# EAGLE design MotorDriver (EAGLE 9.6.2)
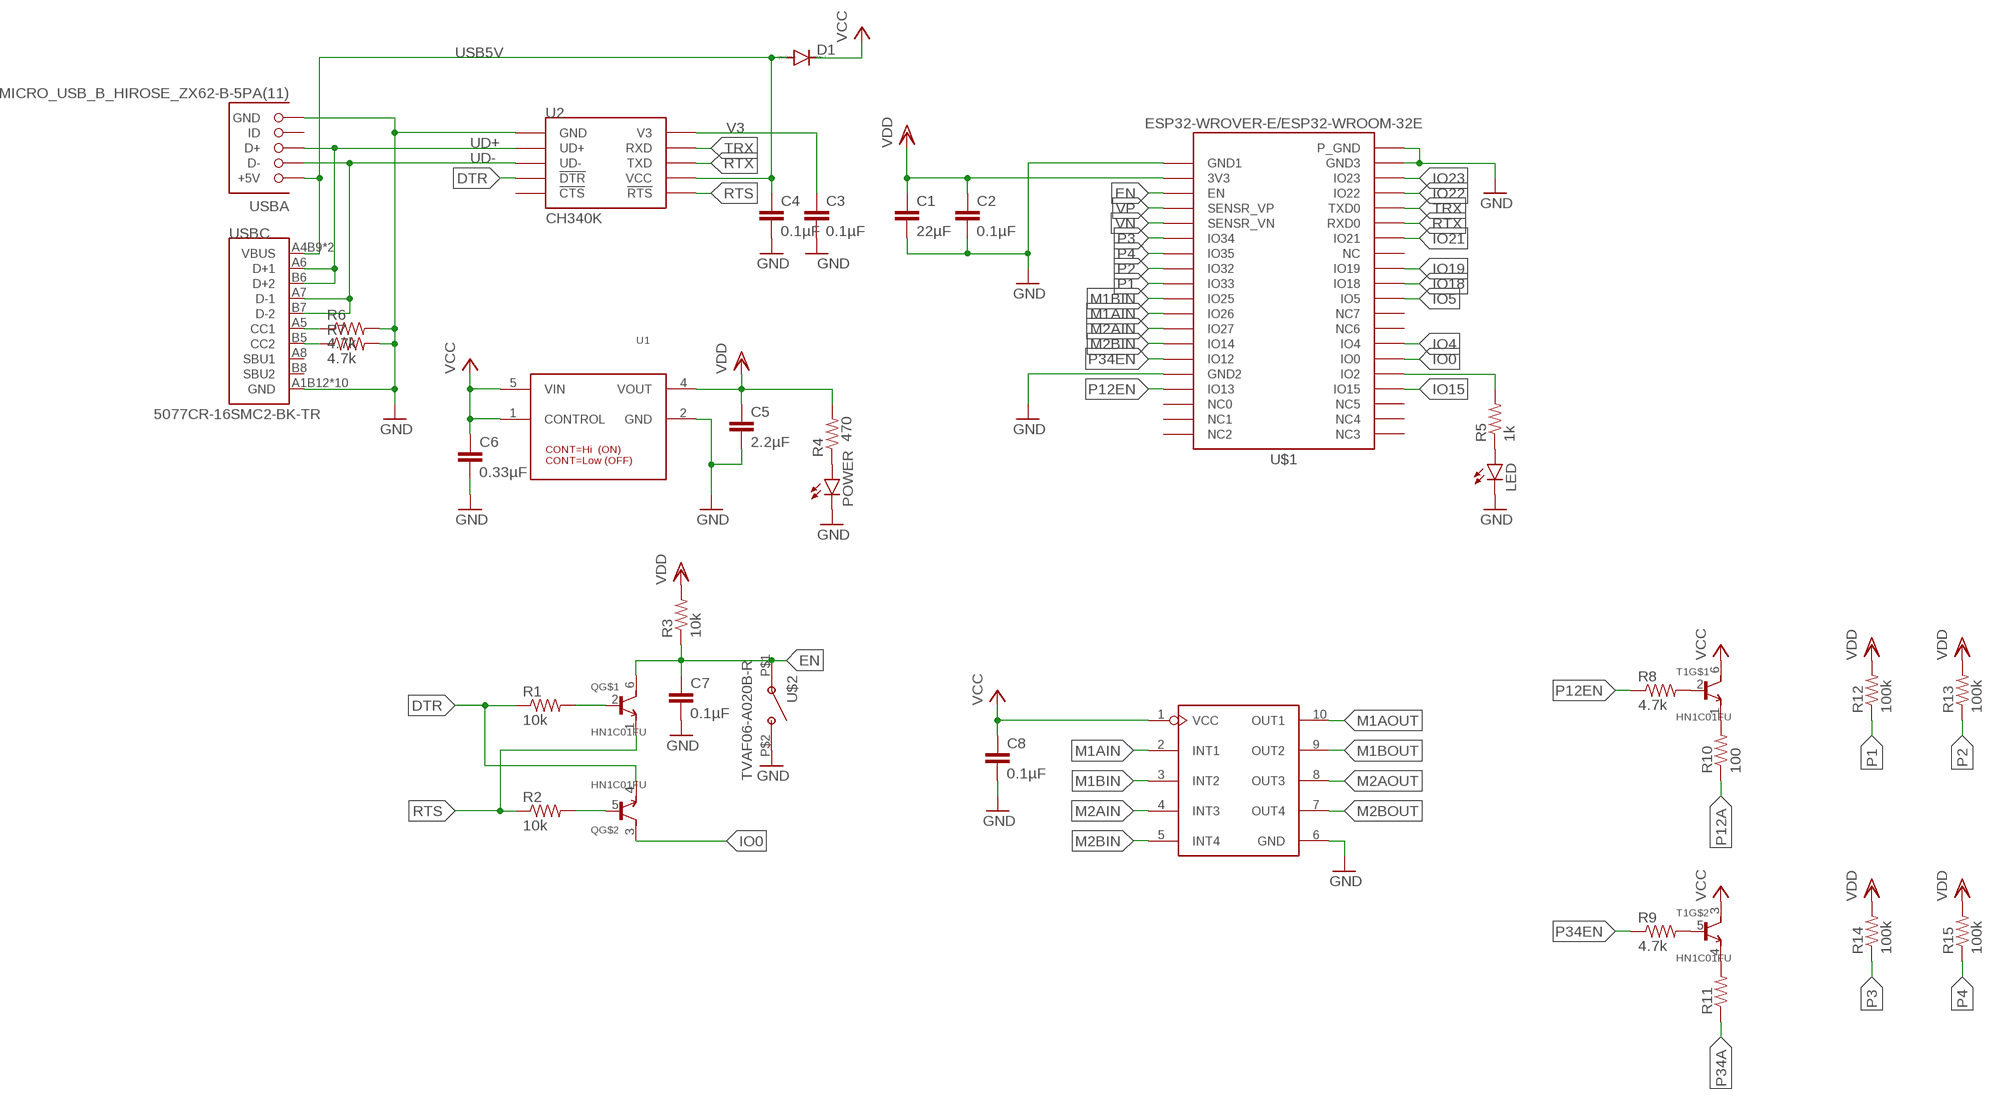
[diagram p0: schematic, sheet 1]

## Parts
C1  22µF  C-EUC0603K  [C0603K]
C2  0.1µF  C-EUC0603K  [C0603K]
C3  0.1µF  C-EUC0603K  [C0603K]
C4  0.1µF  C-EUC0603K  [C0603K]
C5  2.2µF  C-EUC0603K  [C0603K]
C6  0.33µF  C-EUC0603K  [C0603K]
C7  0.1µF  C-EUC0603K  [C0603K]
C8  0.1µF  C-EUC0603  [C0603]
D1  DIODE-SOD123  [SOD123]
LED  LEDCHIPLED_0603  [CHIPLED_0603]
POWER  LEDCHIPLED_0603  [CHIPLED_0603]
Q  HN1C01FU  [SOT-363]
R1  10k  R-US_R0603  [R0603]
R2  10k  R-US_R0603  [R0603]
R3  10k  R-US_R0603  [R0603]
R4  470  R-US_R0603  [R0603]
R5  1k  R-US_R0603  [R0603]
R6  4.7k  R-US_R0603  [R0603]
R7  4.7k  R-US_R0603  [R0603]
R8  4.7k  R-US_R0603  [R0603]
R9  4.7k  R-US_R0603  [R0603]
R10  100  R-US_R0603  [R0603]
R11  R-US_R0603  [R0603]
R12  100k  R-US_R0603  [R0603]
R13  100k  R-US_R0603  [R0603]
R14  100k  R-US_R0603  [R0603]
R15  100k  R-US_R0603  [R0603]
T1  HN1C01FU  [SOT-363]
U1  I-10673_NJM2884U1-33  [NJM2884U1-33]
U2  CH340K  [ESSOP-10]
U3  DRIVER-LV8548MC-AH(SOIC10)  [SOIC10-1.0-5X4MM]
U$1  ESP32-WROVER-E/ESP32-WROOM-32E  [ESP32-WROVER-E/ESP32-WROOM-32E]
U$2  TVAF06-A020B-R  [TVAF06-A020B-R]
USBA  MICRO_USB_B_HIROSE_ZX62-B-5PA(11)  [USB_MICRO_B-HIROSE-ZX62-B-5PA(11)]
USBC  5077CR-16SMC2-BK-TR  [5077CR-16SMC2-BK-TR]

## Nets
DTR: Q.4(E) R1.1 U2.P4(!DTR!)
EN: C7.1 Q.6(C) R3.1 U$1.EN U$2.P$1(A)
GND: C1.2 C2.2 C3.2 C4.2 C5.2 C6.2 C7.2 C8.2 LED.C POWER.C R6.2 R7.2 U1.2(GND) U2.P0(GND) U2.P3(GND) U3.6(GND) U$1.GND1 U$1.GND2 U$1.GND2'(GND2) U$1.GND3 U$1.P_GND U$2.P$2(B) USBA.5(GND) USBC.A1B12(GND) USBC.B1A12(GND) USBC.P$1(GND) USBC.P$2(GND) USBC.P$3(GND) USBC.P$4(GND) USBC.P$5(GND) USBC.P$6(GND) USBC.P$7(GND) USBC.P$8(GND)
IO0: Q.3(C) U$1.IO0
IO2: R5.2 U$1.IO2 U$1.IO2'(IO2)
IO4: U$1.IO4
IO5: U$1.IO5
IO15: U$1.IO15 U$1.IO15'(IO15)
IO18: U$1.IO18
IO19: U$1.IO19
IO21: U$1.IO21
IO22: U$1.IO22
IO23: U$1.IO23
M1AIN: U3.2(INT1) U$1.IO26
M1AOUT: U3.10(OUT1)
M1BIN: U3.3(INT2) U$1.IO25
M1BOUT: U3.9(OUT2)
M2AIN: U3.4(INT3) U$1.IO27
M2AOUT: U3.8(OUT3)
M2BIN: U3.5(INT4) U$1.IO14
M2BOUT: U3.7(OUT4)
N$1: LED.A R5.1
N$14: Q.2(B) R1.2
N$15: Q.5(B) R2.2
N$16: R8.2 T1.2(B)
N$17: R9.2 T1.5(B)
N$18: R10.2 T1.1(E)
N$20: R11.2 T1.4(E)
N$67: R6.1 USBC.A5(CC1)
N$84: POWER.A R4.1
N$107: R7.1 USBC.B5(CC2)
P1: R12.1 U$1.IO33
P2: R13.1 U$1.IO32
P3: R14.1 U$1.IO34
P4: R15.1 U$1.IO35
P12A: R10.1
P12EN: R8.1 U$1.IO13 U$1.IO13'(IO13)
P34A: R11.1
P34EN: R9.1 U$1.IO12
RTS: Q.1(E) R2.1 U2.P6(!RTS!)
RTX: U2.P8(TXD) U$1.RXD0
TRX: U2.P9(RXD) U$1.TXD0
UD+: U2.P1(UD+) USBA.3(D+) USBC.A6(D+1) USBC.B6(D+2)
UD-: U2.P2(UD-) USBA.2(D-) USBC.A7(D-1) USBC.B7(D-2)
USB5V: C4.1 D1.A U2.P7(VCC) USBA.1(+5V) USBC.A4B9(VBUS) USBC.B4A9(VBUS)
V3: C3.1 U2.P10(V3)
VCC: C6.1 C8.1 D1.C T1.3(C) T1.6(C) U1.1(CONTROL) U1.5(VIN) U3.1(VCC)
VDD: C1.1 C2.1 C5.1 R3.2 R4.2 R12.2 R13.2 R14.2 R15.2 U1.4(VOUT) U$1.3V3
VN: U$1.SENSOR_VN(SENSR_VN)
VP: U$1.SENSOR_VP(SENSR_VP)
Unconnected: U2.P5(!CTS!) U$1.IO16(NC6) U$1.IO17(NC7) U$1.NC U$1.NC0 U$1.NC0'(NC0) U$1.NC1 U$1.NC1'(NC1) U$1.NC2 U$1.NC2'(NC2) U$1.NC3 U$1.NC3'(NC3) U$1.NC4 U$1.NC4'(NC4) U$1.NC5 U$1.NC5'(NC5) USBA.4(ID) USBC.A8(SBU1) USBC.B8(SBU2)

## Library data of the parts
C1-C8 = rcl:C-EU: CAPACITOR, European symbol; SPICEPREFIX: C
D1 = diode:DIODE-: DIODE
LED POWER = led:LED: LED OSRAM: - CHIPLED LG R971, LG N971, LY N971, LG Q971, LY Q971, LO R971, LY R971 LH N974, LH R974 LS Q976, LO Q976, LY Q976 LO Q996 - Hyper CHIPLED LW Q18S LB Q993, LB Q99A, LB R99A - SideLED LS A670, LO A670, LY A670, LG A670, LP A670 LB A673, LV A673, LT A673, LW A673 LH A674 LY A675 LS A676, LA A676, LO A676, LY A676, LW A676 LS A679, LY A679, LG A679 - Hyper Micro SIDELED® LS Y876, LA Y876, LO Y876, LY Y876 LT Y87S - SmartLED LW L88C, LW L88S LB L89C, LB L89S, LG L890 LS L89K, LO L89K, LY L89K LS L896, LA L896, LO L896, LY L896 - TOPLED LS T670, LO T670, LY T670, LG T670, LP T670 LSG T670, LSP T670, LSY T670, LOP T670, LYG T670 LG T671, LOG T671, LSG T671 LB T673, LV T673, LT T673, LW T673 LH T674 LS T676, LA T676, LO T676, LY T676, LB T676, LH T676, LSB T676, LW T676 LB T67C, LV T67C, LT T67C, LS T67K, LO T67K, LY T67K, LW E67C LS E67B, LA E67B, LO E67B, LY E67B, LB E67C, LV E67C, LT E67C LW T67C LS T679, LY T679, LG T679 LS T770, LO T770, LY T770, LG T770, LP T770 LB T773, LV T773, LT T773, LW T773 LH T774 LS E675, LA E675, LY E675, LS T675 LS T776, LA T776, LO T776, LY T776, LB T776 LHGB T686 LT T68C, LB T68C - Hyper Mini TOPLED® LB M676 - Mini TOPLED Santana® LG M470 LS M47K, LO M47K, LY M47K Source: http://www.osram.convergy.de LUXEON: - LUMILED® LXK2-PW12-R00, LXK2-PW12-S00, LXK2-PW14-U00, LXK2-PW14-V00 LXK2-PM12-R00, LXK2-PM12-S00, LXK2-PM14-U00 LXK2-PE12-Q00, LXK2-PE12-R00, LXK2-PE12-S00, LXK2-PE14-T00, LXK2-PE14-U00 LXK2-PB12-K00, LXK2-PB12-L00, LXK2-PB12-M00, LXK2-PB14-N00, LXK2-PB14-P00, LXK2-PB14-Q00 LXK2-PR12-L00, LXK2-PR12-M00, LXK2-PR14-Q00, LXK2-PR14-R00 LXK2-PD12-Q00, LXK2-PD12-R00, LXK2-PD12-S00 LXK2-PH12-R00, LXK2-PH12-S00 LXK2-PL12-P00, LXK2-PL12-Q00, LXK2-PL12-R00 Source: www.luxeon.com KINGBRIGHT: KA-3528ASYC Source: www.kingbright.com
Q T1 = transistors:HN1C01FU
R1-R15 = rcl:R-US_: RESISTOR, American symbol; SPICEPREFIX: R
U1 = akizuki:I-10673_NJM2884U1-33
U2 = CH340:CH340K
U3 = DRIVER-LV8548MC-AH_SOIC10_:DRIVER-LV8548MC-AH(SOIC10): 310030259 Check prices <https://pricing.snapeda.com/parts/LV8548MC-AH/ON%20Semiconductor/view-part?ref=eda>; AVAILABILITY: Not in stock; DESCRIPTION: Half Bridge (4) Driver DC Motors, General Purpose, Stepper Motors DMOS 10-SOIC; MF: ON Semiconductor; MP: LV8548MC-AH; PACKAGE: SOIC NB-10 ON Semiconductor; PRICE: None
U$1 = esp32:ESP32-WROVER-E/ESP32-WROOM-32E
U$2 = switches:TVAF06-A020B-R
USBA = connector:MICRO_USB_B_HIROSE_ZX62-B-5PA(11): Connector Receptacle USB - micro B 2.0 5 Position Surface Mount, Right Angle, Horizontal Bottom Mount; DIGIKEY: H11634CT-ND; MOUSER: 798-ZX62-B-5PA11; NEWARK: 86P8793
USBC = connectors:5077CR-16SMC2-BK-TR

## Board
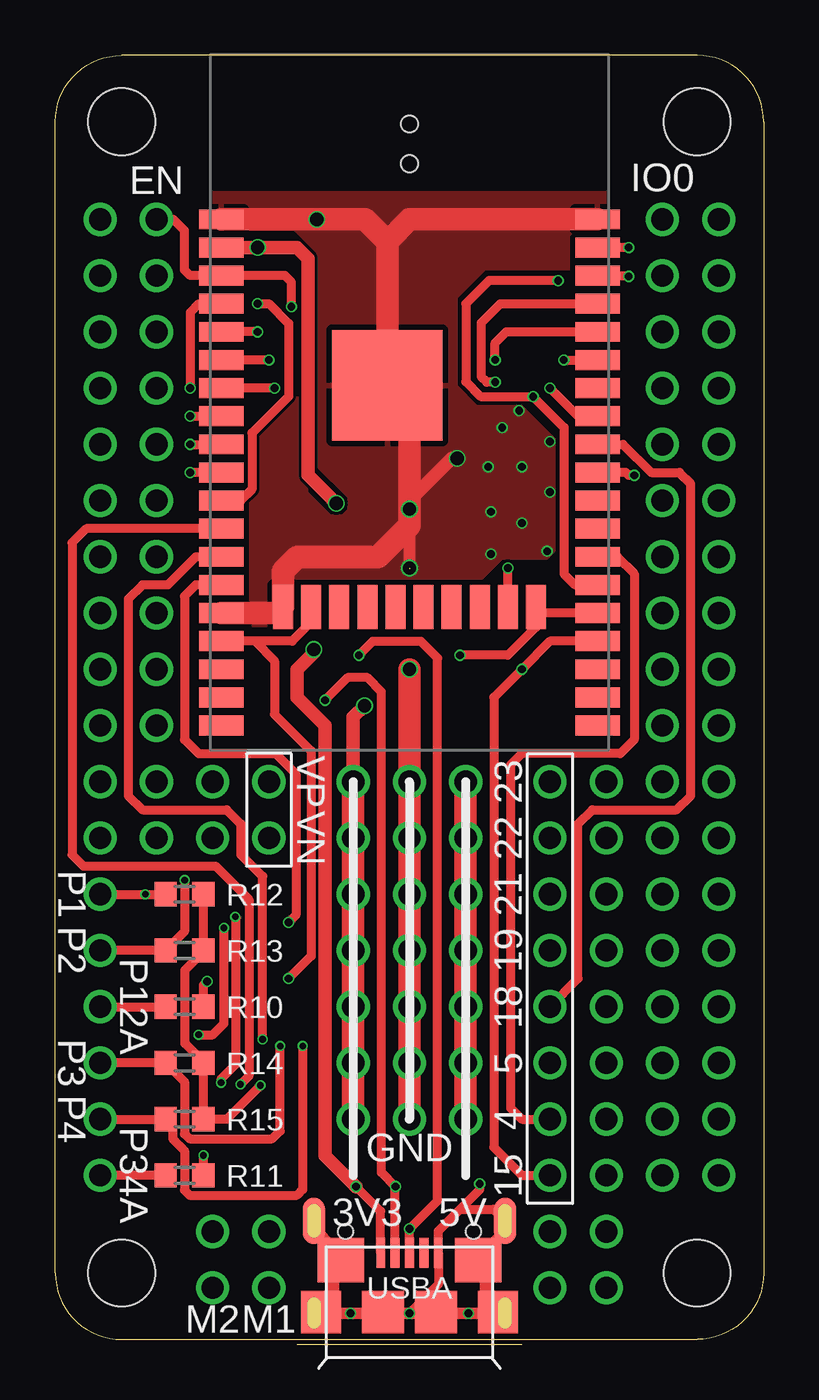
[diagram p1: board, top side]
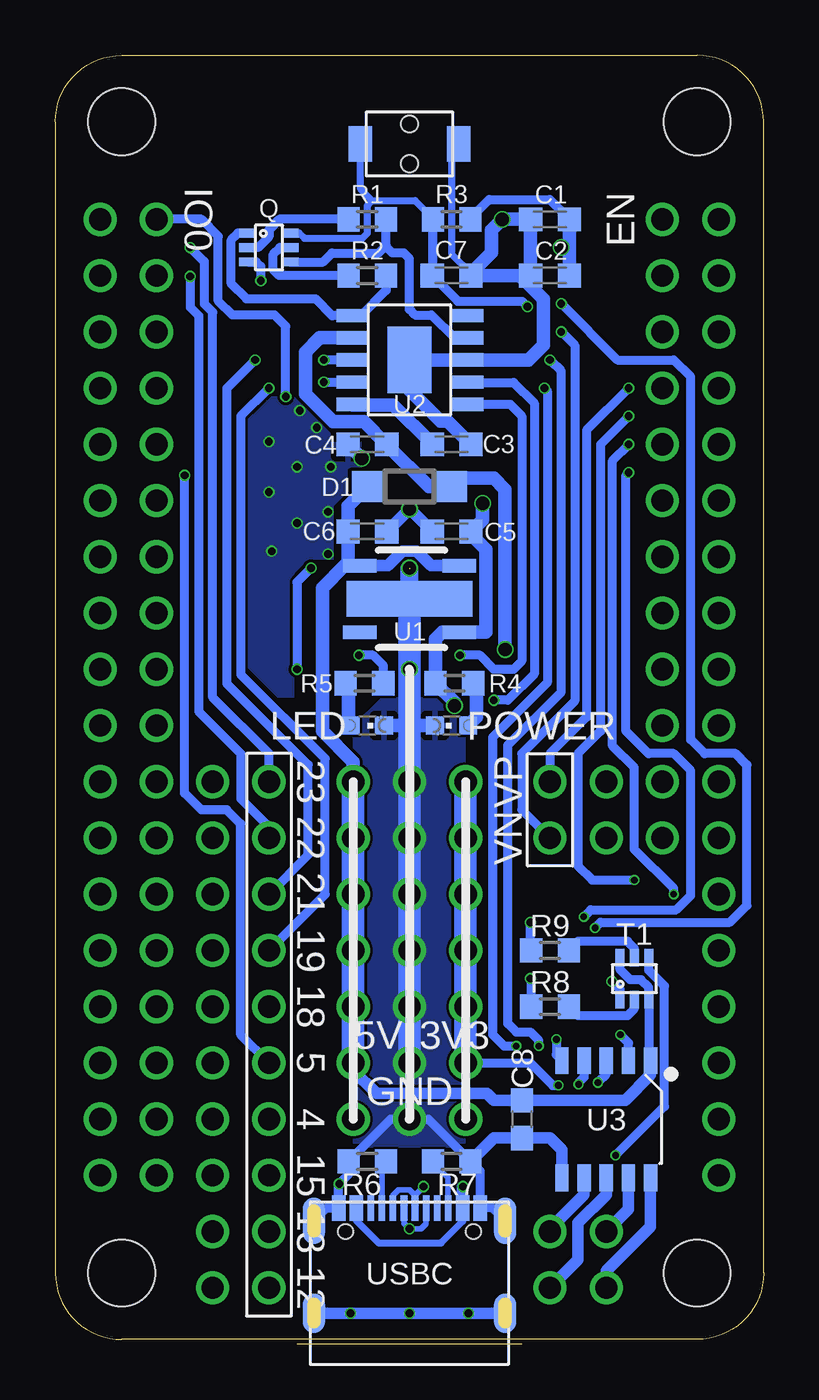
[diagram p2: board, bottom side, seen from below]

Size 32 x 58 mm. Coordinates in mm from the lower left corner, seen from the top.
Outline: 29,58 3,58 arc90 0,55 0,3 arc90 3,0 29,0 arc90 32,3 32,55 arc90 29,58
Copper layers (1*16): Top 0.035mm / dielectric 1mm / Bottom 0.035mm
Design rules "jlcpcb-2layers-1.0mm": minimum track width 5mil, minimum drill 0.3mm, track to track 5mil, track to pad 5mil, pad to pad 5mil, via to via 5mil, smd to smd 5mil, copper to edge 0.2mm, drill to drill 6mil, minimum pad ring 10mil, minimum via ring 3mil, stop-mask expansion 4mil, vias tented up to drill 0mil, thermal gap 10mil
Holes 3 mm at 3,55 29,55 29,3 3,3

### Footprints (pad centres in the part's own frame; a part is rotated, then mirrored left to right if it is on the bottom)
C0603K = smd 1.05 x 1.08: 1 -0.875,0; 2 0.875,0
C0603 = smd 1.1 x 1: 1 -0.85,0; 2 0.85,0
SOD123 = smd 1.4 x 1.4: A 1.9,0; C -1.9,0
CHIPLED_0603 = smd 0.8 x 0.8: A 0,-0.75; C 0,0.75
SOT-363 = smd 0.4 x 0.8: 1 -0.65,-0.95; 2 0,-0.95; 3 0.65,-0.95; 4 0.65,0.95; 5 0,0.95; 6 -0.65,0.95
R0603 = smd 1 x 1.1: 1 -0.85,0; 2 0.85,0
NJM2884U1-33 = smd 0.6 x 1.5: 1 -1.5,-2.25; 3 1.5,-2.25; 4 1.5,2.25; 5 -1.5,2.25 | smd 1.6 x 5.7: 2 0,0
ESSOP-10 = smd 2 x 3: P0 0,0 | smd 1.5 x 0.6: P1 -2.6,2; P2 -2.6,1; P3 -2.6,0; P4 -2.6,-1; P5 -2.6,-2 | smd 1.4 x 0.6: P6 2.6,-2; P7 2.6,-1; P8 2.6,0; P9 2.6,1; P10 2.6,2
SOIC10-1.0-5X4MM = smd 0.6 x 1.2: 1 -2,-2.65; 2 -1,-2.65; 3 0,-2.65; 4 1,-2.65; 5 2,-2.65; 6 2,2.65; 7 1,2.65; 8 0,2.65; 9 -1,2.65; 10 -2,2.65
ESP32-WROVER-E/ESP32-WROOM-32E = smd 2 x 0.9: 3V3 -8.5,10.16; EN -8.5,8.89; GND1 -8.5,11.43; GND2 -8.5,-6.35; GND3 8.5,11.43; IO0 8.5,-5.08; IO2 8.5,-6.35; IO4 8.5,-3.81; IO5 8.5,0; IO12 -8.5,-5.08; IO13 -8.5,-7.62; IO14 -8.5,-3.81; IO15 8.5,-7.62; IO16 8.5,-2.54; IO17 8.5,-1.27; IO18 8.5,1.27; IO19 8.5,2.54; IO21 8.5,5.08; IO22 8.5,8.89; IO23 8.5,10.16; IO25 -8.5,0; IO26 -8.5,-1.27; IO27 -8.5,-2.54; IO32 -8.5,2.54; IO33 -8.5,1.27; IO34 -8.5,5.08; IO35 -8.5,3.81; NC 8.5,3.81; NC0 -8.5,-8.89; NC1 -8.5,-10.16; NC2 -8.5,-11.43; NC3 8.5,-11.43; NC4 8.5,-10.16; NC5 8.5,-8.89; RXD0 8.5,6.35; SENSOR_VN -8.5,6.35; SENSOR_VP -8.5,7.62; TXD0 8.5,7.62 | smd 0.9 x 2: GND2' -5.715,-6.08; IO2' 5.715,-6.08; IO13' -4.445,-6.08; IO15' 4.445,-6.08; NC0' -3.175,-6.08; NC1' -1.905,-6.08; NC2' -0.635,-6.08; NC3' 0.635,-6.08; NC4' 1.905,-6.08; NC5' 3.175,-6.08 | smd 5 x 5: P_GND -1,3.93
TVAF06-A020B-R = smd 1.6 x 1.05: P$1 0,2.225; P$2 0,-2.225 | hole 0.75: -0.9,0; 0.9,0
USB_MICRO_B-HIROSE-ZX62-B-5PA(11) = smd 0.4 x 1.35: 1 -1.3,4.125; 2 -0.65,4.125; 3 0,4.125; 4 0.65,4.125; 5 1.3,4.125 | smd 2.1 x 2: P$1 3.1,3.8; P$2 -3.1,3.8 | smd 1.8 x 1.9: P$3 -4,1.45; P$6 4,1.45 | smd 1.9 x 1.9: P$4 -1.2,1.45; P$5 1.2,1.45
5077CR-16SMC2-BK-TR = smd 0.6 x 1.14: A1B12 -3.2,4.75; A4B9 -2.4,4.75; B1A12 3.2,4.75; B4A9 2.4,4.75 | smd 0.3 x 1.14: A5 -1.25,4.75; A6 -0.25,4.75; A7 0.25,4.75; A8 1.25,4.75; B5 1.75,4.75; B6 0.75,4.75; B7 -0.75,4.75; B8 -1.75,4.75 | smd 1 x 1.8: P$1 -4.32,0; P$3 4.32,0 | smd 1 x 1.8 bottom: P$2 -4.32,0; P$4 4.32,0 | smd 1 x 2.1: P$5 -4.32,4.18; P$7 4.32,4.18 | smd 1 x 2.1 bottom: P$6 -4.32,4.18; P$8 4.32,4.18 | hole 0.65: -2.89,3.68; 2.89,3.68

### Placement (x,y rotation side)
C1  9.65,50.59 180 bottom
C2  9.65,48.05 180 bottom
C3  14.1,40.43 0 bottom
C4  17.91,40.43 180 bottom
C5  14.1,36.49 180 bottom
C6  17.91,36.49 0 bottom
C7  14.1,48.05 0 bottom
C8  10.92,9.95 270 bottom
D1  16,38.52 0 bottom
LED  17.91,27.73 270 bottom
POWER  14.1,27.73 90 bottom
Q  22.35,49.32 270 bottom
R1  17.91,50.59 180 bottom
R2  17.91,48.05 180 bottom
R3  14.1,50.59 0 bottom
R4  13.97,29.64 180 bottom
R5  18.03,29.64 0 bottom
R6  17.91,8.05 180 bottom
R7  14.1,8.05 0 bottom
R8  9.65,15.03 0 bottom
R9  9.65,17.57 0 bottom
R10  5.84,15.03 0 top
R11  5.84,7.41 0 top
R12  5.84,20.11 0 top
R13  5.84,17.57 0 top
R14  5.84,12.49 0 top
R15  5.84,9.95 0 top
T1  5.84,16.3 0 bottom
U1  16,33.45 270 bottom
U2  16,44.24 180 bottom
U3  7.11,9.95 180 bottom
U$1  16,39.16 0 top
U$2  16,54 90 bottom
USBA  16,-0.21 0 top
USBC  16,1.19 0 bottom

### Tracks (layer width: path | path; a pad name or v marks a point on that pad's centre or on a via)
DTR
  Bottom 0.406: U2.P4 13.97,45.24 15.01,46.27 15.75,46.27 16,46.53 16,48.81 16.25,49.07 16.76,49.07 17.05,49.36 17.05,49.41 | Q.4 19.91,48.67 19.51,49.07 17.4,49.07 17.05,49.41 | 17.05,49.41 R1.1
EN  (via drill 0.35, 1 pad 1.5)
  Top 0.406: v10.67,46.65 10.67,47.75 10.37,48.05 U$1.EN 6.09,48.05 5.84,48.3 5.84,50.08 5.33,50.59 v4.57,50.59
  Bottom 0.305: R3.1 14.95,50.64 15.75,51.45 17.68,51.45 | 17.68,51.45 17.91,51.22 17.91,49.96 18.13,49.73 20.75,49.73 20.98,49.97 Q.6 | U$2.P$1 18.23,51.99 17.68,51.45
  Bottom 0.406: R3.1 14.97,50.56 C7.1 13.82,46.9 10.91,46.9 v10.67,46.65
GND  (via drill 0.35, 0.6, 1 pad 1.5)  (1 unrouted)
  Top 0.406: 18.29,5.89 17.3,4.9 USBA.5 17.3,2.49 v16,1.19 | 18.29,5.89 19.8,5.89 USBC.P$5 | 18.29,5.89 19.18,6.77 v19.18,7.03
  Top 0.508: v16,34.84 v16,37.51 | USBC.P$5 20.32,4.86 19.43,3.97 19.43,2.08 USBC.P$2 v18.67,1.19 v16,1.19 v13.33,1.19 USBC.P$4 12.57,2.08 12.57,4.1 11.68,4.99 USBC.P$8
  Top 0.61: v16,37.51 16,37.89 17.91,39.8 v18.16,39.8
  Top 1.016: v16,30.27 v16,25.19 v16,22.65 v16,20.11 v16,17.57 v16,15.03 v16,12.49 v16,9.95 | U$1.GND2 10.02,32.81 U$1.GND2' 10.29,34.72 10.92,35.35 13.59,35.35 13.61,35.33 14.58,35.33 16,36.75 v16,37.51 16,42.09 U$1.P_GND 15,49.59 | U$1.GND3 16,50.59 15,49.59 | U$1.GND1 v11.81,50.59 14,50.59 15,49.59
  Bottom 0.305: U$2.P$2 14.1,53.68 14.1,49.03 13.22,48.16
  Bottom 0.406: USBC.P$8 12.25,5.94 USBC.B1A12 12.8,7.6 R7.2 15.15,9.95 v16,9.95 16.85,9.95 R6.2 18.75,7.45 v19.18,7.03 19.2,7 USBC.A1B12 19.75,5.94 USBC.P$5
  Bottom 0.508: C5.2 15.99,37.51 v16,37.51 17.02,36.49 C6.2 | USBC.P$4 v13.33,1.19 v16,1.19 v18.67,1.19 USBC.P$2 | U3.6 9.11,8.56 9.65,9.1 C8.2 12.19,9.1 R7.2
  Bottom 0.61: C3.2 14.27,41.48 14.59,41.48 16,42.89 U2.P0 U2.P3 10.63,44.24 9.96,44.91 9.96,47 11.01,48.05 C7.2 | C7.2 C2.2 C1.2 v11.81,50.59 12.29,50.11 12.29,49.09 13.22,48.16 C7.2 | LED.C 16,27.73 POWER.C | v18.16,39.8 18.16,39.81 C4.2
  Bottom 0.813: U1.2 16,34.8
  Bottom 1.016: U1.2 v16,30.27 16,27.73 v16,25.19 v16,12.49
  other vias: 22.35,40.56 20.95,41.95 21.08,39.41 20.19,41.19 19.56,39.41 19.68,37.38 21.08,36.87 22.22,35.6 19.68,35.48 22.35,38.27
  pour Top: 7.11,51.86 24.89,51.86 24.89,50.59 23.62,50.59 23.62,50.21 23.24,49.83 23.24,48.3 19.43,48.3 18.16,47.03 18.16,43.1 19.05,42.21 21.08,42.21 22.6,40.68 22.6,35.6 22.22,35.22 20.19,35.22 19.3,34.33 10.54,34.33 10.54,32.3 10.41,32.17 8.89,32.17 8.89,32.3 8.76,32.43 8.76,42.59 11.43,42.59 11.43,38.27 12.44,37.26 12.95,37.26 13.21,37.51 13.21,38.02 11.81,39.41 11.81,49.07 10.79,50.08 7.11,50.08
  pour Bottom: 21.21,42.59 23.11,42.59 23.87,41.83 23.87,30.91 21.97,29 21.21,29 21.21,34.59 20.57,35.22 19.43,35.22 19.43,37.64 18.79,38.27 18.79,39.29 18.67,39.41 18.16,39.41 18.16,40.81 18.29,40.94 19.56,40.94
  pour Bottom: 17.27,29 13.46,29 13.46,8.68 18.54,8.68 18.54,27.73
IO0  (via drill 0.35, 1 pad 1.5)
  Top 0.406: U$1.IO0 23.48,34.08 22.98,34.58 22.98,41.19 v21.59,42.59 19.22,42.59 18.55,43.26 18.55,46.78 19.59,47.82 v22.71,47.82
  Bottom 0.406: Q.3 22.92,48.67 22.71,48.47 v22.71,47.82 | v21.59,42.59 21.59,45.76 22.1,46.27 24,46.27 24.64,46.91 24.64,49.83 25.4,50.59 v27.43,50.59
IO2  (via drill 0.35)
  Top 0.406: U$1.IO2 21.98,32.81 U$1.IO2' 21.71,32.17 20.45,30.91 v18.29,30.91
  Bottom 0.406: R5.2 17.18,30.44 17.65,30.91 v18.29,30.91
IO4  (via drill 1 pad 1.5)
  Top 0.406: U$1.IO4 25.4,35.35 26.16,34.59 26.16,27.09 25.52,26.46 21.08,26.46 20.57,25.95 20.57,10.46 21.08,9.95 v22.35,9.95
IO5  (via drill 0.35, 1 pad 1.5)
  Top 0.406: v26.16,39.03 25.9,39.03 25.77,39.16 U$1.IO5
  Bottom 0.406: v22.35,12.49 23.62,13.76 23.62,23.29 24.26,23.92 25.4,23.92 26.16,24.68 v26.16,39.03
IO15  (via drill 0.35, 1 pad 1.5)
  Top 0.406: U$1.IO15 22.35,31.54 v21.08,30.27 19.81,29 19.81,8.68 21.08,7.41 v22.35,7.41 | U$1.IO15' v20.45,34.84
  Bottom 0.406: v20.45,34.84 21.08,34.21 v21.08,30.27
IO18  (via drill 1 pad 1.5)
  Top 0.406: v22.35,15.03 23.62,16.3 23.62,23.29 24.26,23.92 28.06,23.92 28.7,24.55 28.7,38.65 28.19,39.16 26.92,39.16 25.65,40.43 U$1.IO18
IO19  (via drill 0.35, 1 pad 1.5)
  Top 0.406: U$1.IO19 23.62,41.7 v22.35,42.97
  Bottom 0.406: v22.35,17.57 19.81,20.11 19.81,26.23 23.62,30.04 23.62,41.7 v22.35,42.97
IO21  (via drill 0.35, 1 pad 1.5)
  Top 0.406: v22.97,44.24 U$1.IO21
  Bottom 0.406: v22.35,20.11 20.57,21.89 20.57,25.95 24.26,29.64 24.26,42.95 v22.97,44.24
IO22  (via drill 0.35, 1 pad 1.5)
  Top 0.406: U$1.IO22 25.91,48.05 v25.91,48.02
  Bottom 0.406: v25.91,48.02 25.91,46.62 25.52,46.24 25.52,28.36 23.62,26.46 23.62,24.43 22.35,23.16 v22.35,22.65
IO23  (via drill 0.35, 1 pad 1.5)
  Top 0.406: v25.91,49.32 U$1.IO23
  Bottom 0.406: v22.35,25.19 22.35,26.46 24.89,29 24.89,46.4 25.27,46.78 25.27,48.69 v25.91,49.32
M1AIN  (via drill 0.3, 0.35)
  Top 0.406: v9.14,46.78 9.65,46.78 10.54,45.89 10.54,42.59 8.89,40.94 8.89,38.4 8.38,37.89 U$1.IO26 | v6.47,13.76 7.11,13.76 7.62,14.27 v7.62,18.59
  Bottom 0.406: v9.14,46.78 6.6,44.24 4.06,44.24 3.3,43.48 3.3,27.09 2.66,26.46 1.27,26.46 0.76,25.95 0.76,19.6 1.52,18.84 7.36,18.84 v7.62,18.59 | v6.47,13.76 6.11,13.39 U3.2
M1AOUT  (via drill 1 pad 1.5)
  Bottom 0.508: U3.10 5.11,5.09 7.11,3.09 v7.11,2.33
M1BIN  (via drill 0.3, 0.35)
  Top 0.406: U$1.IO25 v6.09,39.16 | v7.49,11.6 7.49,11.77 8.17,12.46 8.17,19.05 v8.13,19.09
  Bottom 0.406: v6.09,39.16 6.22,39.03 6.22,27.48 5.21,26.46 4.06,26.46 3.3,25.7 3.3,20.05 3.94,19.41 7.81,19.41 v8.13,19.09 | U3.3 7.11,11.98 v7.49,11.6
M1BOUT  (via drill 1 pad 1.5)
  Bottom 0.508: v7.11,4.87 6.11,5.87 U3.9
M2AIN  (via drill 0.3)
  Top 0.406: U$1.IO27 1.39,36.62 0.76,35.98 0.76,21.89 1.27,21.38 7.24,21.38 8.75,19.87 8.75,11.9 v8.36,11.52
  Bottom 0.406: v8.36,11.52 8.36,11.58 8.11,11.84 U3.4
M2AOUT  (via drill 1 pad 1.5)
  Bottom 0.508: U3.8 7.11,6.54 8.38,5.27 8.38,3.6 v9.65,2.33
M2BIN  (via drill 0.3)
  Top 0.406: U$1.IO14 6.35,35.35 5.08,34.08 3.94,34.08 3.3,33.45 3.3,24.55 3.94,23.92 7.74,23.92 8.38,23.29 8.38,21.9 9.36,20.92 v9.36,13.55
  Bottom 0.406: U3.5 9.36,12.85 v9.36,13.55
M2BOUT  (via drill 1 pad 1.5)
  Bottom 0.508: U3.7 8.11,6.54 9.65,5 v9.65,4.87
N$1
  Bottom 0.61: R5.1 18.75,29.51 18.75,27.83 LED.A
N$9  (via drill 1 pad 1.5)
  other vias: 24.89,25.19
N$10  (via drill 1 pad 1.5)
  other vias: 24.89,22.65
N$11  (via drill 1 pad 1.5)
  other vias: 24.89,20.11
N$12  (via drill 1 pad 1.5)
  other vias: 24.89,17.57
N$14
  Bottom 0.406: Q.2 22.85,49.32 22.35,49.82 22.35,50.12 21.88,50.59 R1.2
N$15
  Bottom 0.406: Q.5 21.85,49.32 22.16,49.02 22.16,48.32 21.88,48.05 R2.2
N$16
  Bottom 0.406: T1.2 5.84,14.93 6.15,14.62 8.39,14.62 R8.2
N$17
  Bottom 0.406: T1.5 5.84,17.67 6.15,17.98 8.39,17.98 R9.2
N$18  (via drill 0.35)
  Top 0.406: R10.2 6.69,16.01 v6.86,16.17
  Bottom 0.406: T1.1 6.49,15.81 v6.86,16.17
N$20  (via drill 0.3)
  Top 0.406: R11.2 v6.69,8.31
  Bottom 0.406: v6.69,8.31 4.48,10.52 4.48,15.96 5.19,16.67 T1.4
N$22  (via drill 1 pad 1.5)
  other vias: 24.89,15.03
N$24  (via drill 1 pad 1.5)
  other vias: 29.97,7.41
N$25  (via drill 1 pad 1.5)
  other vias: 24.89,12.49
N$26  (via drill 1 pad 1.5)
  other vias: 24.89,9.95
N$27  (via drill 1 pad 1.5)
  other vias: 24.89,2.33
N$28  (via drill 1 pad 1.5)
  other vias: 27.43,25.19
N$29  (via drill 1 pad 1.5)
  other vias: 27.43,22.65
N$30  (via drill 1 pad 1.5)
  other vias: 27.43,20.11
N$31  (via drill 1 pad 1.5)
  other vias: 27.43,17.57
N$32  (via drill 1 pad 1.5)
  other vias: 27.43,15.03
N$33  (via drill 1 pad 1.5)
  other vias: 27.43,12.49
N$34  (via drill 1 pad 1.5)
  other vias: 27.43,9.95
N$36  (via drill 1 pad 1.5)
  other vias: 29.97,25.19
N$37  (via drill 1 pad 1.5)
  other vias: 29.97,22.65
N$38  (via drill 1 pad 1.5)
  other vias: 29.97,20.11
N$39  (via drill 1 pad 1.5)
  other vias: 29.97,17.57
N$40  (via drill 1 pad 1.5)
  other vias: 29.97,15.03
N$41  (via drill 1 pad 1.5)
  other vias: 29.97,12.49
N$42  (via drill 1 pad 1.5)
  other vias: 29.97,9.95
N$49  (via drill 1 pad 1.5)
  other vias: 22.35,2.33
N$50  (via drill 1 pad 1.5)
  other vias: 22.35,4.87
N$52  (via drill 1 pad 1.5)
  other vias: 7.11,25.19
N$53  (via drill 1 pad 1.5)
  other vias: 7.11,22.65
N$60  (via drill 1 pad 1.5)
  other vias: 4.57,25.19
N$61  (via drill 1 pad 1.5)
  other vias: 4.57,22.65
N$67
  Bottom 0.254: USBC.A5 17.25,7.85 R6.1
N$68  (via drill 1 pad 1.5)
  other vias: 2.03,25.19
N$69  (via drill 1 pad 1.5)
  other vias: 2.03,22.65
N$84
  Bottom 0.61: R4.1 12.96,29.48 12.96,28.11 POWER.A
N$85  (via drill 1 pad 1.5)
  other vias: 27.43,7.41
N$86  (via drill 1 pad 1.5)
  other vias: 24.89,7.41
N$90  (via drill 1 pad 1.5)
  other vias: 24.89,4.87
N$97  (via drill 1 pad 1.5)
  other vias: 4.57,37.89
N$98  (via drill 1 pad 1.5)
  other vias: 4.57,35.35
N$99  (via drill 1 pad 1.5)
  other vias: 4.57,32.81
N$100  (via drill 1 pad 1.5)
  other vias: 4.57,30.27
N$101  (via drill 1 pad 1.5)
  other vias: 4.57,27.73
N$102  (via drill 1 pad 1.5)
  other vias: 2.03,37.89
N$103  (via drill 1 pad 1.5)
  other vias: 2.03,35.35
N$104  (via drill 1 pad 1.5)
  other vias: 2.03,32.81
N$105  (via drill 1 pad 1.5)
  other vias: 2.03,30.27
N$106  (via drill 1 pad 1.5)
  other vias: 2.03,27.73
N$107
  Bottom 0.254: USBC.B5 14.25,7.3 14.95,8 R7.1
N$108  (via drill 1 pad 1.5)
  other vias: 4.57,48.05
N$109  (via drill 1 pad 1.5)
  other vias: 4.57,45.51
N$110  (via drill 1 pad 1.5)
  other vias: 4.57,42.97
N$111  (via drill 1 pad 1.5)
  other vias: 4.57,40.43
N$112  (via drill 1 pad 1.5)
  other vias: 2.03,50.59
N$113  (via drill 1 pad 1.5)
  other vias: 2.03,48.05
N$114  (via drill 1 pad 1.5)
  other vias: 2.03,45.51
N$115  (via drill 1 pad 1.5)
  other vias: 2.03,42.97
N$116  (via drill 1 pad 1.5)
  other vias: 2.03,40.43
N$117  (via drill 1 pad 1.5)
  other vias: 29.97,37.89
N$118  (via drill 1 pad 1.5)
  other vias: 29.97,35.35
N$119  (via drill 1 pad 1.5)
  other vias: 29.97,32.81
N$120  (via drill 1 pad 1.5)
  other vias: 29.97,30.27
N$121  (via drill 1 pad 1.5)
  other vias: 29.97,27.73
N$122  (via drill 1 pad 1.5)
  other vias: 27.43,37.89
N$123  (via drill 1 pad 1.5)
  other vias: 27.43,35.35
N$124  (via drill 1 pad 1.5)
  other vias: 27.43,32.81
N$125  (via drill 1 pad 1.5)
  other vias: 27.43,30.27
N$126  (via drill 1 pad 1.5)
  other vias: 27.43,27.73
N$127  (via drill 1 pad 1.5)
  other vias: 29.97,50.59
N$128  (via drill 1 pad 1.5)
  other vias: 29.97,48.05
N$129  (via drill 1 pad 1.5)
  other vias: 29.97,45.51
N$130  (via drill 1 pad 1.5)
  other vias: 29.97,42.97
N$131  (via drill 1 pad 1.5)
  other vias: 29.97,40.43
N$133  (via drill 1 pad 1.5)
  other vias: 27.43,48.05
N$134  (via drill 1 pad 1.5)
  other vias: 27.43,45.51
N$135  (via drill 1 pad 1.5)
  other vias: 27.43,42.97
N$136  (via drill 1 pad 1.5)
  other vias: 27.43,40.43
P1  (via drill 0.3, 0.35, 1 pad 1.5)
  Top 0.406: v2.03,20.11 v4.06,20.11 R12.1 | v6.09,40.43 U$1.IO33
  Bottom 0.406: v6.09,40.43 6.83,39.69 6.83,26.82 5.84,25.82 5.84,22.14 4.06,20.36 v4.06,20.11
P2  (via drill 0.3, 0.35, 1 pad 1.5)
  Top 0.406: v2.03,17.57 R13.1 5.84,18.42 v5.84,20.74 | v6.09,41.7 U$1.IO32
  Bottom 0.406: v6.09,41.7 7.36,40.43 7.36,27.48 8.38,26.46 8.38,21.38 7.74,20.74 v5.84,20.74
P3  (via drill 0.3, 0.35, 1 pad 1.5)
  Top 0.406: v2.03,12.49 R14.1 5.84,11.64 5.84,9.28 6.06,9.06 9.8,9.06 10.16,9.42 v10.16,13.25 | v9.65,44.24 U$1.IO34
  Bottom 0.406: v10.16,13.25 10.16,13.51 10.54,13.89 11.17,13.89 11.55,14.27 11.55,26.84 9.14,29.25 9.14,43.73 v9.65,44.24
P4  (via drill 0.3, 0.35, 1 pad 1.5)
  Top 0.406: v2.03,9.95 R15.1 5.31,9.63 5.31,9.06 5.84,8.53 5.84,6.74 6.06,6.52 10.92,6.52 11.17,6.77 v11.17,13.25 | v9.9,42.97 U$1.IO35
  Bottom 0.406: v9.9,42.97 9.78,42.84 9.78,29.66 12.24,27.2 12.24,13.77 11.72,13.25 v11.17,13.25
P12A  (via drill 1 pad 1.5)
  Top 0.406: v2.03,15.03 R10.1
P12EN  (via drill 0.35)
  Top 0.406: U$1.IO13' 11.47,33 11.47,32.31 10.7,31.54 9.02,31.54 | 9.02,31.54 U$1.IO13 | 9.02,31.54 9.9,30.65 9.9,28.24 11.55,26.59 11.55,17.32 v10.54,16.3
  Bottom 0.406: R8.1 10.5,16.26 v10.54,16.3
P34A  (via drill 1 pad 1.5)
  Top 0.406: R11.1 v2.03,7.41
P34EN  (via drill 0.35)
  Top 0.406: U$1.IO12 6.35,34.08 5.84,33.57 5.84,27.09 6.47,26.46 9.94,26.46 10.87,25.53 10.87,19.17 v10.54,18.84
  Bottom 0.406: R9.1 10.54,17.61 v10.54,18.84
RTS
  Bottom 0.406: R2.1 17.05,47.39 18.2,46.24 U2.P6 19.49,46.24 20.25,47 23.37,47 24.06,47.69 24.06,49.67 23.75,49.97 Q.1
RTX  (via drill 0.35)
  Top 0.406: U$1.RXD0 20.38,45.51 19.87,45 v19.87,44.24
  Bottom 0.406: U2.P8 v19.87,44.24
TRX  (via drill 0.35)
  Top 0.406: U$1.TXD0 20.1,46.78 19.23,45.91 19.23,43.49 19.49,43.24 v19.87,43.24
  Bottom 0.406: v19.87,43.24 U2.P9
UD+  (via drill 0.35)
  Top 0.406: v13.71,30.91 14.35,31.54 16.51,31.54 17.27,30.78 17.27,6.27 v16,5 USBA.3
  Bottom 0.254: USBC.A6 16.25,5.25 v16,5 15.48,5 15.25,5.23 USBC.B6
  Bottom 0.406: U2.P1 11.46,42.24 10.92,41.7 10.92,30.65 11.3,30.27 12.19,30.27 12.82,30.91 v13.71,30.91
UD-  (via drill 0.35)
  Top 0.406: v12.19,28.87 13.21,29.89 14.1,29.89 14.73,29.25 14.73,7.54 v15.37,6.9 15.35,6.89 USBA.2
  Bottom 0.254: 15.75,6.52 USBC.A7 15.75,6.52 | 15.75,6.52 15.99,6.76 16.5,6.76 16.75,6.52 USBC.B7 | 15.75,6.52 15.51,6.76 15.48,6.76 v15.37,6.9
  Bottom 0.406: U2.P2 13.38,43.22 11.3,43.22 10.36,42.28 10.36,30.07 11.55,28.87 v12.19,28.87
USB5V  (via drill 0.35, 0.6)
  Top 0.406: USBA.1 14.7,5.79 v13.59,6.9
  Top 0.61: v11.68,31.16 11.68,31.03 10.92,30.27 10.92,29 12.19,27.73 12.19,8.3 v13.59,6.9
  Bottom 0.305: USBC.A4B9 18.4,5.36 17.4,4.36 14.57,4.36 13.6,5.34 USBC.B4A9
  Bottom 0.406: U2.P7 19.91,45.24 20.6,44.54
  Bottom 0.508: USBC.B4A9 13.6,6.89 v13.59,6.9
  Bottom 0.61: v11.68,31.16 11.68,38.39 12.2,38.91 13.72,38.91 D1.A 15.12,38.52 C4.1 18.05,41.45 19.45,41.45 20.7,42.7 20.7,44.59 20.05,45.24 U2.P7
V3
  Bottom 0.61: U2.P10 18.57,42.21 16.73,42.21 14.97,40.45 C3.1
VCC  (via drill 1 pad 1.5)
  Top 1.016: v18.54,25.19 v18.54,22.65 v18.54,20.11 v18.54,17.57 v18.54,15.03 v18.54,12.49 v18.54,9.95
  Bottom 0.406: T1.6 6.49,16.71 6.03,16.25 5.54,16.25 5.19,15.89 T1.3 5.19,12.68 U3.1
  Bottom 0.508: U1.5 15.03,34.95 15.69,35.6 16.31,35.6 16.97,34.95 U1.1 | U3.1 5.11,11.94 6.25,10.8 C8.1 12.19,10.8 12.5,11.11 17.48,11.11 18.54,12.16 v18.54,12.49
  Bottom 0.61: D1.C 18.78,37.64 C6.1 18.78,34.95 U1.1 18.92,34.95 19.94,33.93 19.94,27.48 18.54,26.08 v18.54,25.19
  Bottom 1.016: v18.54,25.19 v18.54,12.49
VDD  (via drill 0.3, 0.6, 1 pad 1.5)
  Top 0.406: R12.2 R13.2 6.69,17.52 5.86,16.69 5.86,13.37 6.69,12.54 R14.2 R15.2 7.74,9.95 v9.27,11.47
  Top 0.61: U$1.3V3 v9.14,49.32 10.92,49.32 11.43,48.81 11.43,39.03 v12.7,37.76 | v13.46,25.19 13.46,28.11 v13.97,28.62
  Top 1.016: v13.46,9.95 v13.46,12.49 v13.46,15.03 v13.46,17.57 v13.46,20.11 v13.46,22.65 v13.46,25.19
  Bottom 0.406: C1.1 8.78,50.61 9.66,51.49 12.4,51.49 13.25,50.64 R3.2 | v13.46,12.49 10.54,12.49 9.52,11.47 v9.27,11.47
  Bottom 0.61: v12.7,37.76 12.7,37.02 C5.1 13.22,36.35 12.54,35.67 12.54,31.95 U1.4 14.51,31.95 14.82,31.64 R4.2 13.97,28.79 v13.97,28.62 | C1.1 8.78,49.33 8.79,49.32 v9.14,49.32 8.78,49.32 C2.1
  Bottom 1.016: v13.46,12.49 v13.46,25.19
VN  (via drill 0.35, 1 pad 1.5)
  Top 0.406: v9.14,45.51 U$1.SENSOR_VN
  Bottom 0.406: v9.65,22.65 10.92,23.92 10.92,26.46 8.53,28.85 8.53,44.9 v9.14,45.51
VP  (via drill 0.35, 1 pad 1.5)
  Top 0.406: v6.09,42.97 6.09,46.39 6.48,46.78 U$1.SENSOR_VP
  Bottom 0.406: v6.09,42.97 8,41.06 8,28.11 9.65,26.46 v9.65,25.19

### Text on the board
tNames: EN | IO0 | VP | 23 | VN | 22 | P1 | 21 | P2 | 19 | P12A | 18 | P3 | 5 | P4 | 4 | GND | P34A | 15 | 3V3 | 5V | M2 | M1
bNames: EN | IO0 | VP | 23 | VN | 22 | 21 | 19 | 18 | 3V3 | 5V | 5 | GND | 4 | 15 | 13 | 12